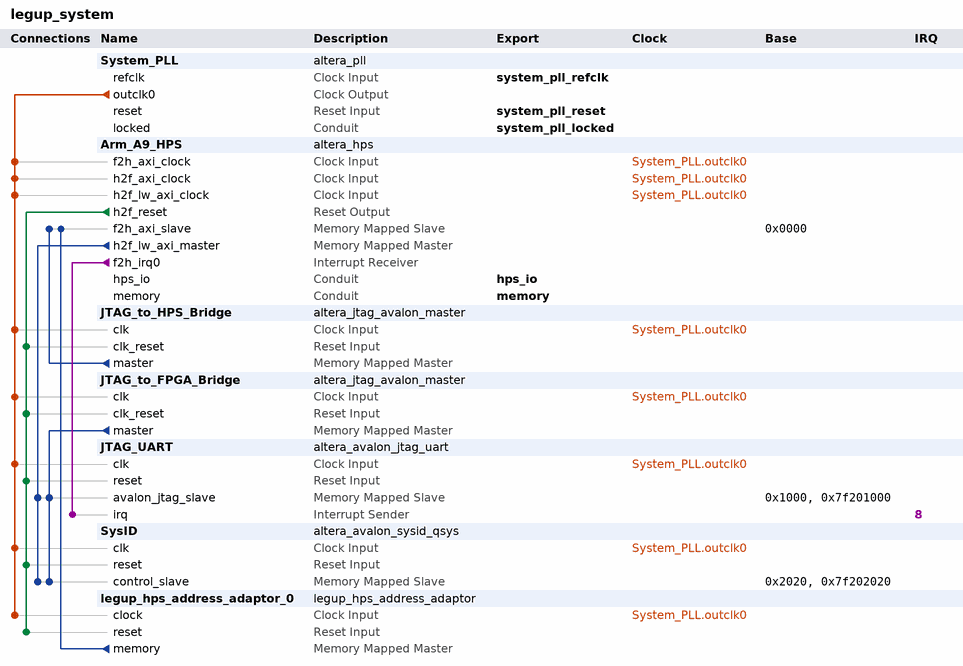
[diagram p0: system contents]
# Platform Designer (Qsys) system legup_system, Cyclone V 5CSXFC6D6F31C8ES
# Parameters at their usual value, and those the tool derives, are not listed.
package require -exact qsys 15.0
create_system legup_system
set_project_property DEVICE_FAMILY {Cyclone V}
set_project_property DEVICE 5CSXFC6D6F31C8ES

add_instance System_PLL altera_pll 15.0
set_instance_parameter_value System_PLL gui_device_speed_grade 2
set_instance_parameter_value System_PLL gui_number_of_clocks 1
set_instance_parameter_value System_PLL gui_operation_mode direct
set_instance_parameter_value System_PLL gui_output_clock_frequency0 50.0
set_instance_parameter_value System_PLL gui_pll_mode {Integer-N PLL}
set_instance_parameter_value System_PLL gui_reference_clock_frequency 50.0
set_instance_parameter_value System_PLL gui_use_locked true

add_instance Arm_A9_HPS altera_hps 15.0
set_instance_parameter_value Arm_A9_HPS EMAC1_Mode N/A
set_instance_parameter_value Arm_A9_HPS EMAC1_PinMuxing Unused
set_instance_parameter_value Arm_A9_HPS F2SCLK_COLDRST_Enable false
set_instance_parameter_value Arm_A9_HPS F2SCLK_DBGRST_Enable false
set_instance_parameter_value Arm_A9_HPS F2SCLK_WARMRST_Enable false
set_instance_parameter_value Arm_A9_HPS F2SINTERRUPT_Enable true
set_instance_parameter_value Arm_A9_HPS F2S_Width 2
set_instance_parameter_value Arm_A9_HPS FPGA_PERIPHERAL_OUTPUT_CLOCK_FREQ_EMAC0_GTX_CLK 100
set_instance_parameter_value Arm_A9_HPS FPGA_PERIPHERAL_OUTPUT_CLOCK_FREQ_EMAC0_MD_CLK 100.0
set_instance_parameter_value Arm_A9_HPS FPGA_PERIPHERAL_OUTPUT_CLOCK_FREQ_EMAC1_GTX_CLK 100
set_instance_parameter_value Arm_A9_HPS FPGA_PERIPHERAL_OUTPUT_CLOCK_FREQ_EMAC1_MD_CLK 100.0
set_instance_parameter_value Arm_A9_HPS HPS_PROTOCOL DDR3
set_instance_parameter_value Arm_A9_HPS I2C0_Mode N/A
set_instance_parameter_value Arm_A9_HPS I2C0_PinMuxing Unused
set_instance_parameter_value Arm_A9_HPS I2C1_Mode N/A
set_instance_parameter_value Arm_A9_HPS I2C1_PinMuxing Unused
set_instance_parameter_value Arm_A9_HPS LWH2F_Enable true
set_instance_parameter_value Arm_A9_HPS MEM_BANKADDR_WIDTH 3
set_instance_parameter_value Arm_A9_HPS MEM_CLK_FREQ 400.0
set_instance_parameter_value Arm_A9_HPS MEM_COL_ADDR_WIDTH 10
set_instance_parameter_value Arm_A9_HPS MEM_DQ_WIDTH 32
set_instance_parameter_value Arm_A9_HPS MEM_DRV_STR RZQ/7
set_instance_parameter_value Arm_A9_HPS MEM_ROW_ADDR_WIDTH 15
set_instance_parameter_value Arm_A9_HPS MEM_RTT_NOM RZQ/4
set_instance_parameter_value Arm_A9_HPS MEM_RTT_WR RZQ/4
set_instance_parameter_value Arm_A9_HPS MEM_TCL 11
set_instance_parameter_value Arm_A9_HPS MEM_TFAW_NS 30.0
set_instance_parameter_value Arm_A9_HPS MEM_TRAS_NS 35.0
set_instance_parameter_value Arm_A9_HPS MEM_TRCD_NS 13.75
set_instance_parameter_value Arm_A9_HPS MEM_TRFC_NS 260.0
set_instance_parameter_value Arm_A9_HPS MEM_TRP_NS 13.75
set_instance_parameter_value Arm_A9_HPS MEM_VENDOR JEDEC
set_instance_parameter_value Arm_A9_HPS MEM_WTCL 8
set_instance_parameter_value Arm_A9_HPS QSPI_Mode N/A
set_instance_parameter_value Arm_A9_HPS QSPI_PinMuxing Unused
set_instance_parameter_value Arm_A9_HPS REF_CLK_FREQ 25.0
set_instance_parameter_value Arm_A9_HPS S2F_Width 3
set_instance_parameter_value Arm_A9_HPS SDIO_Mode N/A
set_instance_parameter_value Arm_A9_HPS SDIO_PinMuxing Unused
set_instance_parameter_value Arm_A9_HPS SPIM1_Mode N/A
set_instance_parameter_value Arm_A9_HPS SPIM1_PinMuxing Unused
set_instance_parameter_value Arm_A9_HPS STM_Enable false
set_instance_parameter_value Arm_A9_HPS TIMING_BOARD_AC_SKEW 0.03
set_instance_parameter_value Arm_A9_HPS TIMING_BOARD_AC_TO_CK_SKEW 0.0
set_instance_parameter_value Arm_A9_HPS TIMING_BOARD_DQ_TO_DQS_SKEW 0.0
set_instance_parameter_value Arm_A9_HPS TIMING_BOARD_MAX_CK_DELAY 0.03
set_instance_parameter_value Arm_A9_HPS TIMING_BOARD_MAX_DQS_DELAY 0.02
set_instance_parameter_value Arm_A9_HPS TIMING_BOARD_SKEW_BETWEEN_DQS 0.08
set_instance_parameter_value Arm_A9_HPS TIMING_BOARD_SKEW_CKDQS_DIMM_MAX 0.16
set_instance_parameter_value Arm_A9_HPS TIMING_BOARD_SKEW_CKDQS_DIMM_MIN 0.09
set_instance_parameter_value Arm_A9_HPS TIMING_BOARD_SKEW_WITHIN_DQS 0.01
set_instance_parameter_value Arm_A9_HPS TIMING_TDH 65
set_instance_parameter_value Arm_A9_HPS TIMING_TDQSCK 255
set_instance_parameter_value Arm_A9_HPS TIMING_TDQSQ 125
set_instance_parameter_value Arm_A9_HPS TIMING_TDS 30
set_instance_parameter_value Arm_A9_HPS TIMING_TIH 140
set_instance_parameter_value Arm_A9_HPS TIMING_TIS 180
set_instance_parameter_value Arm_A9_HPS TIMING_TQSH 0.4
set_instance_parameter_value Arm_A9_HPS UART0_Mode N/A
set_instance_parameter_value Arm_A9_HPS UART0_PinMuxing Unused
set_instance_parameter_value Arm_A9_HPS USB1_Mode N/A
set_instance_parameter_value Arm_A9_HPS USB1_PinMuxing Unused
set_instance_parameter_value Arm_A9_HPS desired_cfg_clk_mhz 50.0
set_instance_parameter_value Arm_A9_HPS desired_qspi_clk_mhz 400.0

add_instance JTAG_to_HPS_Bridge altera_jtag_avalon_master 15.0

add_instance JTAG_to_FPGA_Bridge altera_jtag_avalon_master 15.0

add_instance JTAG_UART altera_avalon_jtag_uart 15.0
set_instance_parameter_value JTAG_UART simInteractiveOptions NO_INTERACTIVE_WINDOWS

add_instance SysID altera_avalon_sysid_qsys 15.0
set_instance_parameter_value SysID id 232849605

add_instance legup_hps_address_adaptor_0 legup_hps_address_adaptor 1.0
set_instance_parameter_value legup_hps_address_adaptor_0 UPPER_BITS 2

# connections
add_connection System_PLL.outclk0 Arm_A9_HPS.f2h_axi_clock clock
add_connection System_PLL.outclk0 Arm_A9_HPS.h2f_axi_clock clock
add_connection System_PLL.outclk0 Arm_A9_HPS.h2f_lw_axi_clock clock
add_connection System_PLL.outclk0 JTAG_to_FPGA_Bridge.clk clock
add_connection System_PLL.outclk0 JTAG_to_HPS_Bridge.clk clock
add_connection System_PLL.outclk0 JTAG_UART.clk clock
add_connection System_PLL.outclk0 legup_hps_address_adaptor_0.clock clock
add_connection System_PLL.outclk0 SysID.clk clock
add_connection Arm_A9_HPS.h2f_reset JTAG_to_FPGA_Bridge.clk_reset reset
add_connection Arm_A9_HPS.h2f_reset JTAG_to_HPS_Bridge.clk_reset reset
add_connection Arm_A9_HPS.h2f_reset JTAG_UART.reset reset
add_connection Arm_A9_HPS.h2f_reset legup_hps_address_adaptor_0.reset reset
add_connection Arm_A9_HPS.h2f_reset SysID.reset reset
add_connection Arm_A9_HPS.h2f_lw_axi_master JTAG_UART.avalon_jtag_slave avalon
set_connection_parameter_value Arm_A9_HPS.h2f_lw_axi_master/JTAG_UART.avalon_jtag_slave baseAddress 0x1000
add_connection Arm_A9_HPS.h2f_lw_axi_master SysID.control_slave avalon
set_connection_parameter_value Arm_A9_HPS.h2f_lw_axi_master/SysID.control_slave baseAddress 0x2020
add_connection JTAG_to_FPGA_Bridge.master JTAG_UART.avalon_jtag_slave avalon
set_connection_parameter_value JTAG_to_FPGA_Bridge.master/JTAG_UART.avalon_jtag_slave baseAddress 0x7f201000
add_connection JTAG_to_FPGA_Bridge.master SysID.control_slave avalon
set_connection_parameter_value JTAG_to_FPGA_Bridge.master/SysID.control_slave baseAddress 0x7f202020
add_connection JTAG_to_HPS_Bridge.master Arm_A9_HPS.f2h_axi_slave avalon
set_connection_parameter_value JTAG_to_HPS_Bridge.master/Arm_A9_HPS.f2h_axi_slave baseAddress 0x0000
add_connection legup_hps_address_adaptor_0.memory Arm_A9_HPS.f2h_axi_slave avalon
set_connection_parameter_value legup_hps_address_adaptor_0.memory/Arm_A9_HPS.f2h_axi_slave baseAddress 0x0000
add_connection Arm_A9_HPS.f2h_irq0 JTAG_UART.irq interrupt
set_connection_parameter_value Arm_A9_HPS.f2h_irq0/JTAG_UART.irq irqNumber 8

# exported interfaces
add_interface hps_io conduit end
set_interface_property hps_io EXPORT_OF Arm_A9_HPS.hps_io
add_interface memory conduit end
set_interface_property memory EXPORT_OF Arm_A9_HPS.memory
add_interface system_pll_locked conduit end
set_interface_property system_pll_locked EXPORT_OF System_PLL.locked
add_interface system_pll_refclk clock sink
set_interface_property system_pll_refclk EXPORT_OF System_PLL.refclk
add_interface system_pll_reset reset sink
set_interface_property system_pll_reset EXPORT_OF System_PLL.reset

set_interconnect_requirement {$system} qsys_mm.clockCrossingAdapter HANDSHAKE
set_interconnect_requirement {$system} qsys_mm.insertDefaultSlave false
set_interconnect_requirement {$system} qsys_mm.maxAdditionalLatency 1
set_interconnect_requirement Arm_A9_HPS.f2h_axi_slave qsys_mm.security SECURE
set_interconnect_requirement JTAG_to_HPS_Bridge.master qsys_mm.security SECURE
set_interconnect_requirement legup_hps_address_adaptor_0.bridge qsys_mm.security NON_SECURE
set_interconnect_requirement legup_hps_address_adaptor_0.memory qsys_mm.security SECURE

save_system legup_system.qsys
